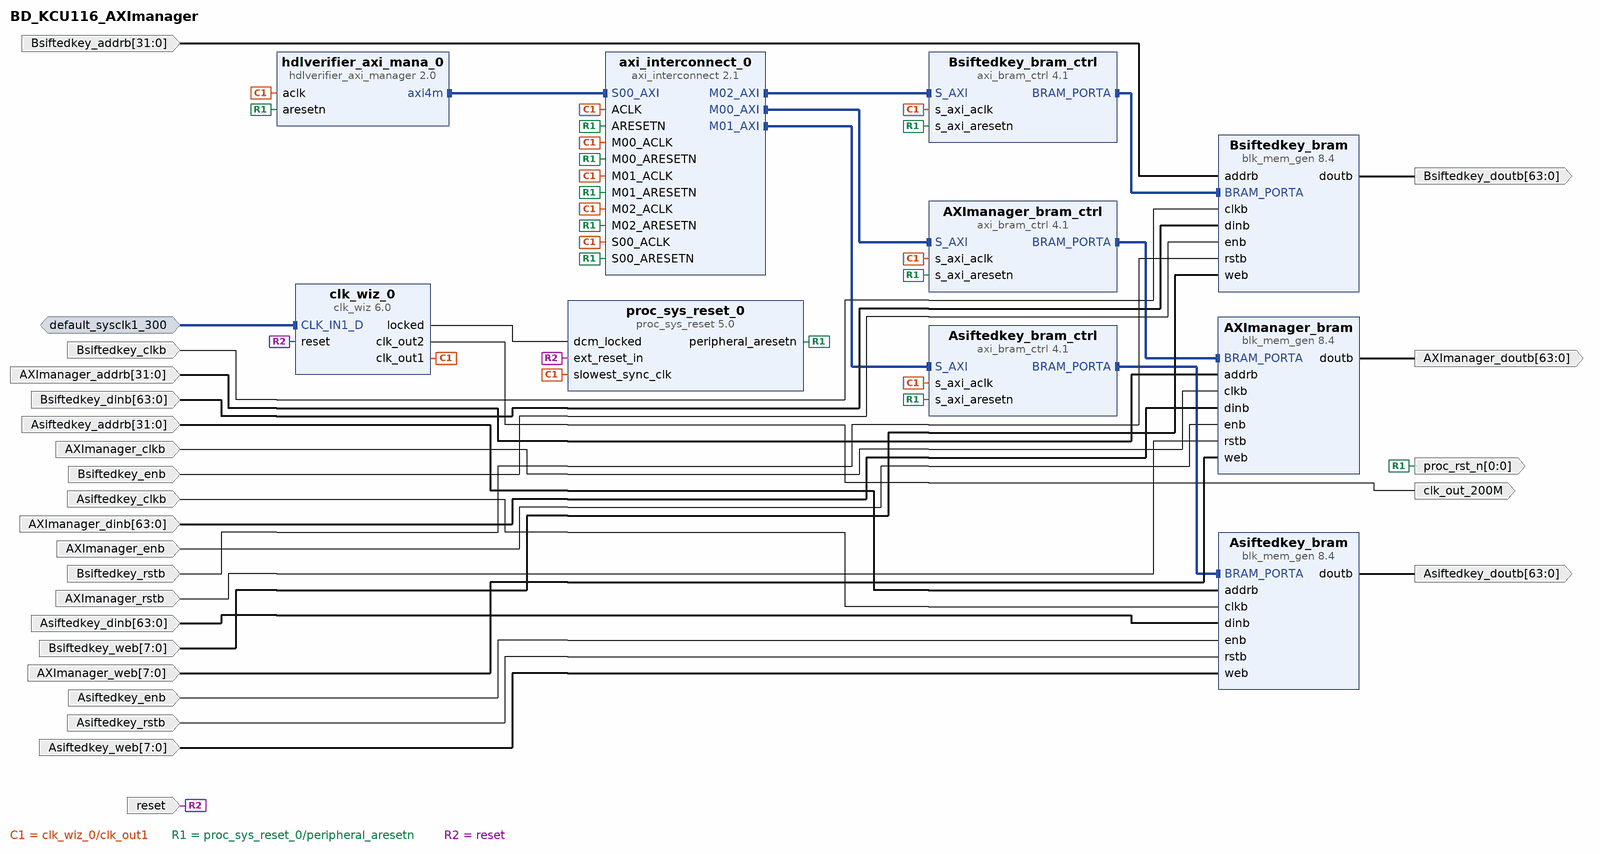
[diagram p0: block diagram of the top level]
# Vivado block design BD_KCU116_AXImanager, xcku5p-ffvb676-2-e, Vivado 2022.1
create_bd_design BD_KCU116_AXImanager

create_bd_intf_port -mode Slave -vlnv xilinx.com:interface:diff_clock_rtl:1.0 default_sysclk1_300
set_property -dict {CONFIG.FREQ_HZ 300000000} [get_bd_intf_ports default_sysclk1_300]
create_bd_port -dir I -type rst reset
set_property -dict {CONFIG.POLARITY ACTIVE_HIGH} [get_bd_ports reset]
create_bd_port -dir I -from 31 -to 0 AXImanager_addrb
create_bd_port -dir I -type clk AXImanager_clkb
create_bd_port -dir I -from 63 -to 0 AXImanager_dinb
create_bd_port -dir O -from 63 -to 0 AXImanager_doutb
create_bd_port -dir I AXImanager_enb
create_bd_port -dir I -type rst AXImanager_rstb
create_bd_port -dir I -from 7 -to 0 AXImanager_web
create_bd_port -dir O -type clk clk_out_200M
create_bd_port -dir O -from 0 -to 0 -type rst proc_rst_n
create_bd_port -dir I -type rst Asiftedkey_rstb
create_bd_port -dir I -from 31 -to 0 Asiftedkey_addrb
create_bd_port -dir I -from 63 -to 0 Asiftedkey_dinb
create_bd_port -dir I -type clk Asiftedkey_clkb
create_bd_port -dir I Asiftedkey_enb
create_bd_port -dir O -from 63 -to 0 Asiftedkey_doutb
create_bd_port -dir I -from 7 -to 0 Asiftedkey_web
create_bd_port -dir I -type rst Bsiftedkey_rstb
create_bd_port -dir O -from 63 -to 0 Bsiftedkey_doutb
create_bd_port -dir I Bsiftedkey_enb
create_bd_port -dir I -type clk Bsiftedkey_clkb
create_bd_port -dir I -from 63 -to 0 Bsiftedkey_dinb
create_bd_port -dir I -from 31 -to 0 Bsiftedkey_addrb
create_bd_port -dir I -from 7 -to 0 Bsiftedkey_web

create_bd_cell -type ip -vlnv mathworks.com:ip:hdlverifier_axi_manager:2.0 hdlverifier_axi_mana_0
set_property -dict {CONFIG.AXI_ADDR_WIDTH 32 CONFIG.AXI_DATA_WIDTH 64} [get_bd_cells hdlverifier_axi_mana_0]
create_bd_cell -type ip -vlnv xilinx.com:ip:clk_wiz:6.0 clk_wiz_0
set_property -dict [list \
  CONFIG.CLKIN1_JITTER_PS 33.330000000000005 \
  CONFIG.CLKOUT1_DRIVES Buffer \
  CONFIG.CLKOUT1_JITTER 88.577 \
  CONFIG.CLKOUT1_PHASE_ERROR 77.836 \
  CONFIG.CLKOUT1_REQUESTED_OUT_FREQ 200.000 \
  CONFIG.CLKOUT2_DRIVES Buffer \
  CONFIG.CLKOUT2_JITTER 88.577 \
  CONFIG.CLKOUT2_PHASE_ERROR 77.836 \
  CONFIG.CLKOUT2_REQUESTED_OUT_FREQ 200.000 \
  CONFIG.CLKOUT2_USED true \
  CONFIG.CLKOUT3_DRIVES Buffer \
  CONFIG.CLKOUT4_DRIVES Buffer \
  CONFIG.CLKOUT5_DRIVES Buffer \
  CONFIG.CLKOUT6_DRIVES Buffer \
  CONFIG.CLKOUT7_DRIVES Buffer \
  CONFIG.CLK_IN1_BOARD_INTERFACE default_sysclk1_300 \
  CONFIG.FEEDBACK_SOURCE FDBK_AUTO \
  CONFIG.MMCM_BANDWIDTH OPTIMIZED \
  CONFIG.MMCM_CLKFBOUT_MULT_F 4.000 \
  CONFIG.MMCM_CLKIN1_PERIOD 3.333 \
  CONFIG.MMCM_CLKIN2_PERIOD 10.0 \
  CONFIG.MMCM_CLKOUT0_DIVIDE_F 6.000 \
  CONFIG.MMCM_CLKOUT1_DIVIDE 6 \
  CONFIG.MMCM_COMPENSATION AUTO \
  CONFIG.MMCM_DIVCLK_DIVIDE 1 \
  CONFIG.NUM_OUT_CLKS 2 \
  CONFIG.OPTIMIZE_CLOCKING_STRUCTURE_EN true \
  CONFIG.PRIMITIVE MMCM \
  CONFIG.PRIM_IN_FREQ 300.000 \
  CONFIG.PRIM_SOURCE Differential_clock_capable_pin \
  CONFIG.RESET_BOARD_INTERFACE reset \
  CONFIG.RESET_PORT reset \
  CONFIG.RESET_TYPE ACTIVE_HIGH \
  CONFIG.USE_BOARD_FLOW true \
  CONFIG.USE_RESET true \
] [get_bd_cells clk_wiz_0]
create_bd_cell -type ip -vlnv xilinx.com:ip:proc_sys_reset:5.0 proc_sys_reset_0
set_property -dict {CONFIG.RESET_BOARD_INTERFACE reset CONFIG.USE_BOARD_FLOW true} [get_bd_cells proc_sys_reset_0]
create_bd_cell -type ip -vlnv xilinx.com:ip:axi_interconnect:2.1 axi_interconnect_0
set_property -dict [list \
  CONFIG.M00_HAS_DATA_FIFO 1 \
  CONFIG.M00_HAS_REGSLICE 4 \
  CONFIG.M01_HAS_DATA_FIFO 1 \
  CONFIG.M01_HAS_REGSLICE 4 \
  CONFIG.M02_HAS_DATA_FIFO 1 \
  CONFIG.M02_HAS_REGSLICE 4 \
  CONFIG.M03_HAS_DATA_FIFO 1 \
  CONFIG.M03_HAS_REGSLICE 3 \
  CONFIG.M04_HAS_DATA_FIFO 1 \
  CONFIG.M05_HAS_DATA_FIFO 1 \
  CONFIG.M06_HAS_DATA_FIFO 1 \
  CONFIG.NUM_MI 3 \
  CONFIG.S00_HAS_DATA_FIFO 1 \
  CONFIG.S00_HAS_REGSLICE 4 \
] [get_bd_cells axi_interconnect_0]
create_bd_cell -type ip -vlnv xilinx.com:ip:axi_bram_ctrl:4.1 AXImanager_bram_ctrl
set_property -dict [list \
  CONFIG.DATA_WIDTH 64 \
  CONFIG.RD_CMD_OPTIMIZATION 1 \
  CONFIG.SINGLE_PORT_BRAM 1 \
] [get_bd_cells AXImanager_bram_ctrl]
create_bd_cell -type ip -vlnv xilinx.com:ip:blk_mem_gen:8.4 AXImanager_bram
set_property -dict [list \
  CONFIG.Enable_B Use_ENB_Pin \
  CONFIG.Memory_Type True_Dual_Port_RAM \
  CONFIG.Port_B_Clock 100 \
  CONFIG.Port_B_Enable_Rate 100 \
  CONFIG.Port_B_Write_Rate 50 \
  CONFIG.Use_RSTB_Pin true \
] [get_bd_cells AXImanager_bram]
create_bd_cell -type ip -vlnv xilinx.com:ip:axi_bram_ctrl:4.1 Asiftedkey_bram_ctrl
set_property -dict [list \
  CONFIG.DATA_WIDTH 64 \
  CONFIG.RD_CMD_OPTIMIZATION 1 \
  CONFIG.SINGLE_PORT_BRAM 1 \
] [get_bd_cells Asiftedkey_bram_ctrl]
create_bd_cell -type ip -vlnv xilinx.com:ip:axi_bram_ctrl:4.1 Bsiftedkey_bram_ctrl
set_property -dict [list \
  CONFIG.DATA_WIDTH 64 \
  CONFIG.RD_CMD_OPTIMIZATION 1 \
  CONFIG.SINGLE_PORT_BRAM 1 \
] [get_bd_cells Bsiftedkey_bram_ctrl]
create_bd_cell -type ip -vlnv xilinx.com:ip:blk_mem_gen:8.4 Asiftedkey_bram
set_property -dict {CONFIG.Memory_Type True_Dual_Port_RAM} [get_bd_cells Asiftedkey_bram]
create_bd_cell -type ip -vlnv xilinx.com:ip:blk_mem_gen:8.4 Bsiftedkey_bram
set_property -dict [list \
  CONFIG.Enable_B Use_ENB_Pin \
  CONFIG.Memory_Type True_Dual_Port_RAM \
  CONFIG.Port_B_Clock 100 \
  CONFIG.Port_B_Enable_Rate 100 \
  CONFIG.Port_B_Write_Rate 50 \
  CONFIG.Use_RSTB_Pin true \
] [get_bd_cells Bsiftedkey_bram]

# ---- connections ----

connect_bd_intf_net -intf_net axi_bram_ctrl_0_BRAM_PORTA [get_bd_intf_pins Asiftedkey_bram_ctrl/BRAM_PORTA] [get_bd_intf_pins Asiftedkey_bram/BRAM_PORTA]
connect_bd_intf_net -intf_net axi_bram_ctrl_1_BRAM_PORTA [get_bd_intf_pins Bsiftedkey_bram_ctrl/BRAM_PORTA] [get_bd_intf_pins Bsiftedkey_bram/BRAM_PORTA]
connect_bd_intf_net -intf_net axi_bram_ctrl_BRAM_PORTA [get_bd_intf_pins AXImanager_bram_ctrl/BRAM_PORTA] [get_bd_intf_pins AXImanager_bram/BRAM_PORTA]
connect_bd_intf_net [get_bd_intf_pins axi_interconnect_0/M00_AXI] [get_bd_intf_pins AXImanager_bram_ctrl/S_AXI]
connect_bd_intf_net [get_bd_intf_pins axi_interconnect_0/M01_AXI] [get_bd_intf_pins Asiftedkey_bram_ctrl/S_AXI]
connect_bd_intf_net [get_bd_intf_pins axi_interconnect_0/M02_AXI] [get_bd_intf_pins Bsiftedkey_bram_ctrl/S_AXI]
connect_bd_intf_net -intf_net default_sysclk1_300_1 [get_bd_intf_ports default_sysclk1_300] [get_bd_intf_pins clk_wiz_0/CLK_IN1_D]
connect_bd_intf_net [get_bd_intf_pins hdlverifier_axi_mana_0/axi4m] [get_bd_intf_pins axi_interconnect_0/S00_AXI]
connect_bd_net [get_bd_pins AXImanager_bram/doutb] [get_bd_ports AXImanager_doutb]
connect_bd_net [get_bd_pins Asiftedkey_bram/doutb] [get_bd_ports Asiftedkey_doutb]
connect_bd_net [get_bd_pins Bsiftedkey_bram/doutb] [get_bd_ports Bsiftedkey_doutb]
connect_bd_net -net addrb_0_1 [get_bd_ports AXImanager_addrb] [get_bd_pins AXImanager_bram/addrb]
connect_bd_net -net addrb_0_2 [get_bd_ports Asiftedkey_addrb] [get_bd_pins Asiftedkey_bram/addrb]
connect_bd_net -net addrb_0_3 [get_bd_ports Bsiftedkey_addrb] [get_bd_pins Bsiftedkey_bram/addrb]
connect_bd_net [get_bd_pins clk_wiz_0/clk_out1] \
  [get_bd_pins hdlverifier_axi_mana_0/aclk] [get_bd_pins axi_interconnect_0/S00_ACLK] \
  [get_bd_pins proc_sys_reset_0/slowest_sync_clk] [get_bd_pins axi_interconnect_0/M00_ACLK] \
  [get_bd_pins axi_interconnect_0/ACLK] [get_bd_pins AXImanager_bram_ctrl/s_axi_aclk] \
  [get_bd_pins Asiftedkey_bram_ctrl/s_axi_aclk] [get_bd_pins axi_interconnect_0/M01_ACLK] \
  [get_bd_pins Bsiftedkey_bram_ctrl/s_axi_aclk] [get_bd_pins axi_interconnect_0/M02_ACLK]
connect_bd_net [get_bd_pins clk_wiz_0/clk_out2] [get_bd_ports clk_out_200M]
connect_bd_net [get_bd_pins clk_wiz_0/locked] [get_bd_pins proc_sys_reset_0/dcm_locked]
connect_bd_net -net clkb_0_1 [get_bd_ports AXImanager_clkb] [get_bd_pins AXImanager_bram/clkb]
connect_bd_net -net clkb_0_2 [get_bd_ports Asiftedkey_clkb] [get_bd_pins Asiftedkey_bram/clkb]
connect_bd_net -net clkb_0_3 [get_bd_ports Bsiftedkey_clkb] [get_bd_pins Bsiftedkey_bram/clkb]
connect_bd_net -net dinb_0_1 [get_bd_ports AXImanager_dinb] [get_bd_pins AXImanager_bram/dinb]
connect_bd_net -net dinb_0_2 [get_bd_ports Asiftedkey_dinb] [get_bd_pins Asiftedkey_bram/dinb]
connect_bd_net -net dinb_0_3 [get_bd_ports Bsiftedkey_dinb] [get_bd_pins Bsiftedkey_bram/dinb]
connect_bd_net -net enb_0_1 [get_bd_ports AXImanager_enb] [get_bd_pins AXImanager_bram/enb]
connect_bd_net -net enb_0_2 [get_bd_ports Asiftedkey_enb] [get_bd_pins Asiftedkey_bram/enb]
connect_bd_net -net enb_0_3 [get_bd_ports Bsiftedkey_enb] [get_bd_pins Bsiftedkey_bram/enb]
connect_bd_net [get_bd_pins proc_sys_reset_0/peripheral_aresetn] \
  [get_bd_pins hdlverifier_axi_mana_0/aresetn] [get_bd_pins axi_interconnect_0/S00_ARESETN] \
  [get_bd_pins axi_interconnect_0/M00_ARESETN] [get_bd_pins axi_interconnect_0/ARESETN] \
  [get_bd_pins AXImanager_bram_ctrl/s_axi_aresetn] [get_bd_ports proc_rst_n] [get_bd_pins Asiftedkey_bram_ctrl/s_axi_aresetn] \
  [get_bd_pins axi_interconnect_0/M01_ARESETN] [get_bd_pins Bsiftedkey_bram_ctrl/s_axi_aresetn] \
  [get_bd_pins axi_interconnect_0/M02_ARESETN]
connect_bd_net [get_bd_ports reset] [get_bd_pins proc_sys_reset_0/ext_reset_in] [get_bd_pins clk_wiz_0/reset]
connect_bd_net -net rstb_0_1 [get_bd_ports AXImanager_rstb] [get_bd_pins AXImanager_bram/rstb]
connect_bd_net -net rstb_0_2 [get_bd_ports Asiftedkey_rstb] [get_bd_pins Asiftedkey_bram/rstb]
connect_bd_net -net rstb_0_3 [get_bd_ports Bsiftedkey_rstb] [get_bd_pins Bsiftedkey_bram/rstb]
connect_bd_net -net web_0_1 [get_bd_ports AXImanager_web] [get_bd_pins AXImanager_bram/web]
connect_bd_net -net web_0_2 [get_bd_ports Asiftedkey_web] [get_bd_pins Asiftedkey_bram/web]
connect_bd_net -net web_0_3 [get_bd_ports Bsiftedkey_web] [get_bd_pins Bsiftedkey_bram/web]

# ---- address map ----
assign_bd_address -offset 0x10000000 -range 256K -target_address_space [get_bd_addr_spaces hdlverifier_axi_mana_0/axi4m] [get_bd_addr_segs Asiftedkey_bram_ctrl/S_AXI/Mem0]
assign_bd_address -offset 0x20000000 -range 256K -target_address_space [get_bd_addr_spaces hdlverifier_axi_mana_0/axi4m] [get_bd_addr_segs Bsiftedkey_bram_ctrl/S_AXI/Mem0]
assign_bd_address -offset 0xC0000000 -range 8K -target_address_space [get_bd_addr_spaces hdlverifier_axi_mana_0/axi4m] [get_bd_addr_segs AXImanager_bram_ctrl/S_AXI/Mem0]

validate_bd_design
save_bd_design
